# EAGLE design Staryu (EAGLE 8.0.2)
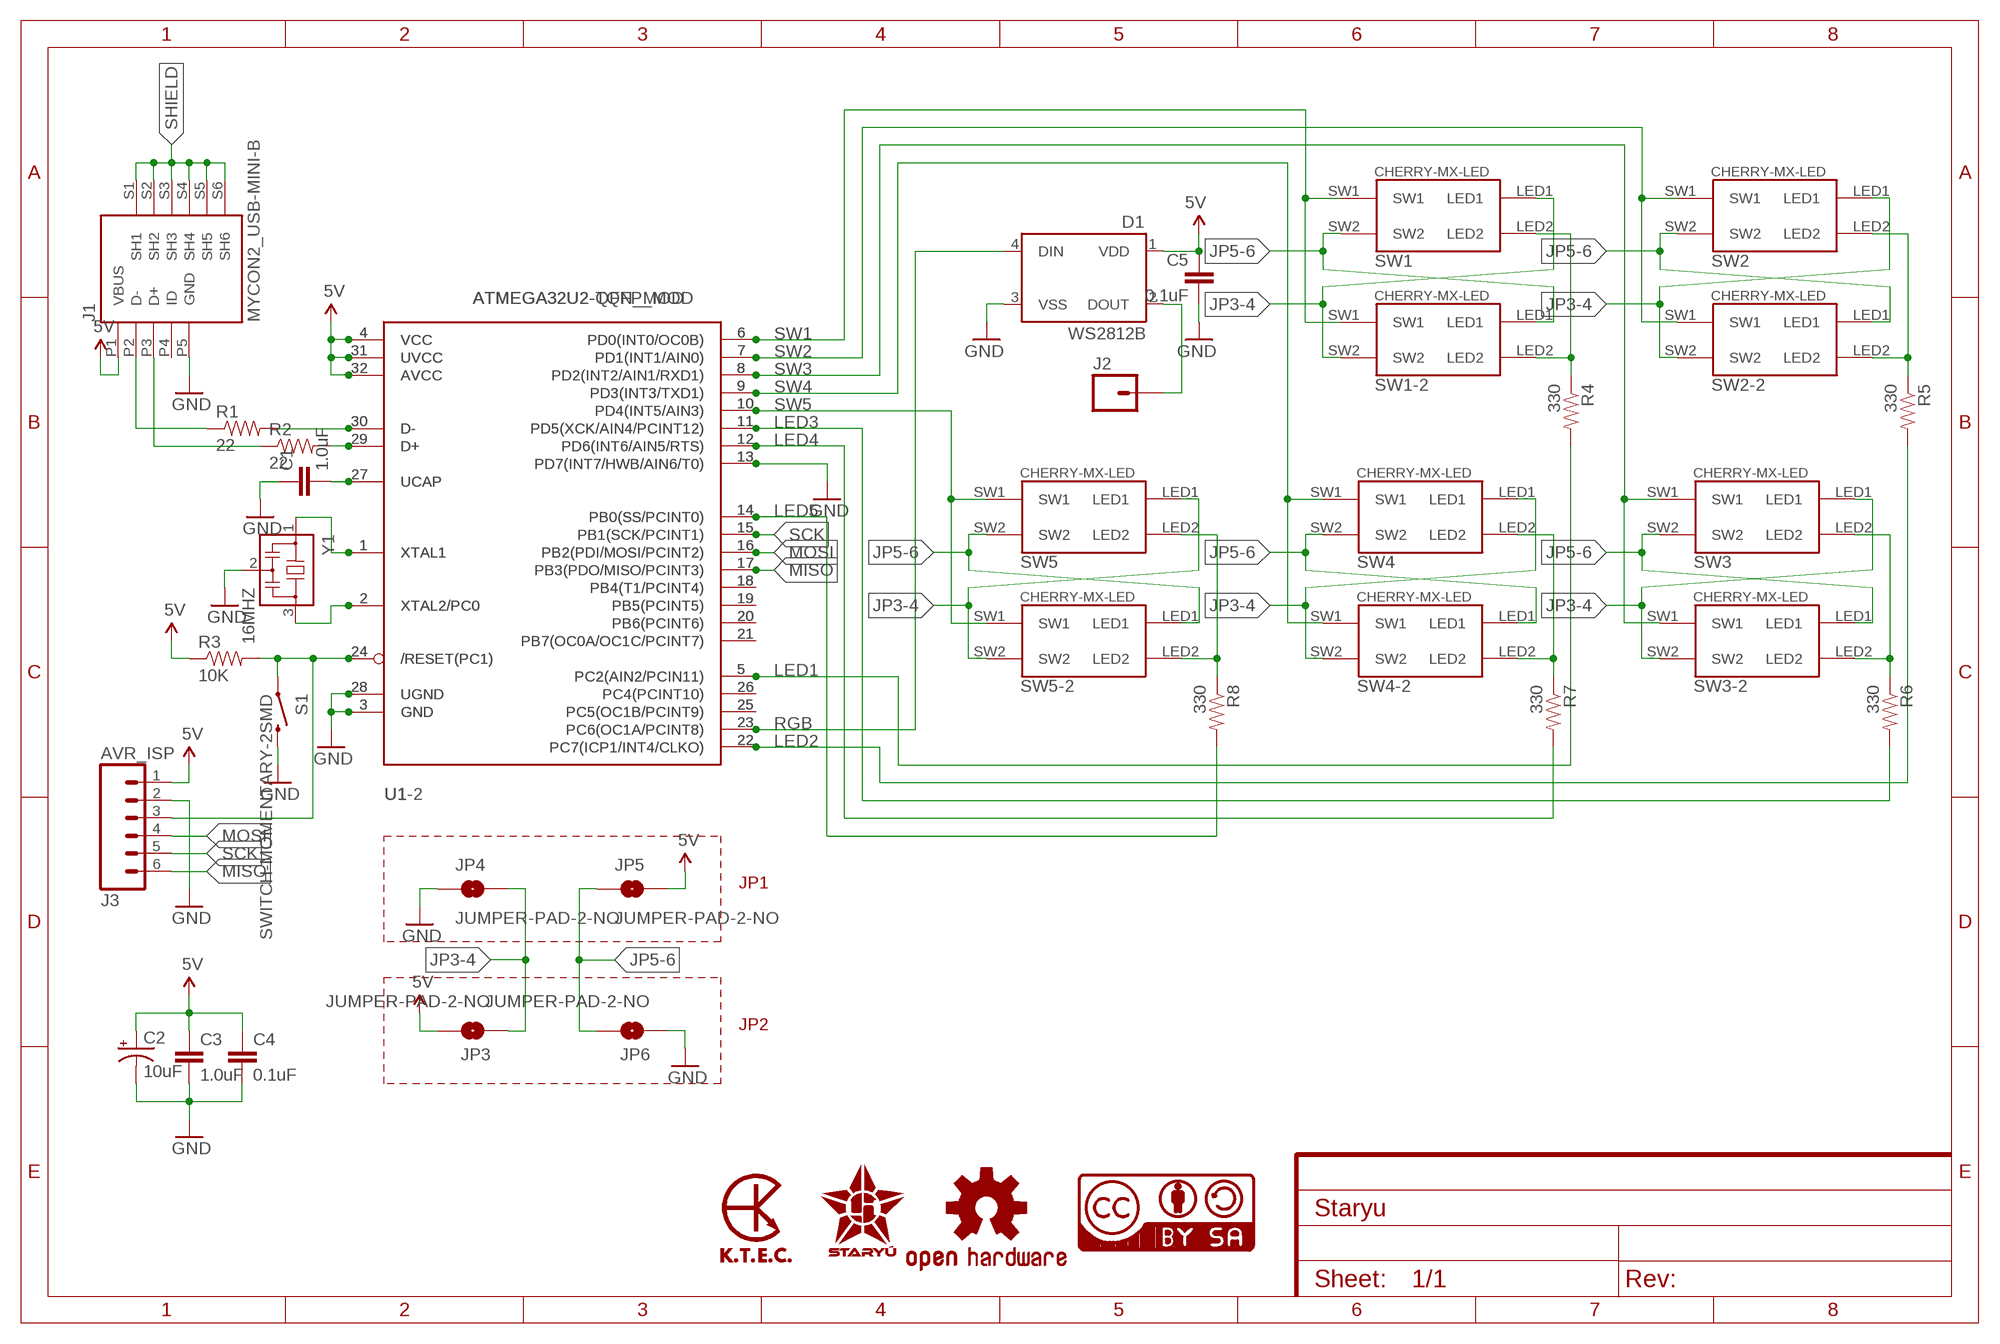
[diagram p0: schematic, sheet 1]
FRAME1 (FRAME-A4L): CREVISION: 1.6; DESIGNER: Kai Ryu

## Parts
C1  1.0uF  1.0UF-25V-+80/-20(0805)"  [0805-CAP]
C2  10uF  10UF-16V-10%(TANT)  [EIA3216]
C3  1.0uF  1.0UF-25V-+80/-20(0805)"  [0805-CAP]
C4  0.1uF  CAP0805  [0805]
C5  0.1uF  CAP0805  [0805]
D1  WS2812B  WS2812BNOSILK  [WS2812B_NOSILK]
J1  MYCON2_USB-MINI-B  [CON2_USB_MICRO_B_AT]
J2  M01PTH_NO_SILK_YES_STOP  [1X01_NO_SILK]
J3  AVR_ISP  M06NO_SILK_FEMALE_PTH  [1X06_NO_SILK]
JP3  JUMPER-PAD-2-NO  [PAD-JUMPER-2-NO_NO_SILK]
JP4  JUMPER-PAD-2-NO  [PAD-JUMPER-2-NO_NO_SILK]
JP5  JUMPER-PAD-2-NO  [PAD-JUMPER-2-NO_NO_SILK]
JP6  JUMPER-PAD-2-NO  [PAD-JUMPER-2-NO_NO_SILK]
LOGO1  K.T.E.C._LOGO3_COPPER_EXP_S  [K.T.E.C._LOGO3_COPPER_EXPOSED_S]
LOGO2  STARYU_LOGO  [STARYU_LOGO]
LOGO3  OSHW_LOGOM_EXP  [OSHW_LOGO_COPPER_EXPOSED_M]
LOGO4  CC-BY-SANIX  [CC-BY-SA_NIX]
R1  22  RESISTOR0805-RES  [0805]
R2  22  RESISTOR0805-RES  [0805]
R3  10K  RESISTOR0805-RES  [0805]
R4  330  RESISTOR0805-RES  [0805]
R5  330  RESISTOR0805-RES  [0805]
R6  330  RESISTOR0805-RES  [0805]
R7  330  RESISTOR0805-RES  [0805]
R8  330  RESISTOR0805-RES  [0805]
S1  SWITCH-MOMENTARY-2SMD  [TACTILE-SWITCH-SMD]
SW1  CHERRY-MX-LED-MOD  [CHERRY-MX-LED-MOD]
SW1-2  CHERRY-MX-LED-MOD  [CHERRY-MX-LED-MOD]
SW2  CHERRY-MX-LED-MOD  [CHERRY-MX-LED-MOD]
SW2-2  CHERRY-MX-LED-MOD  [CHERRY-MX-LED-MOD]
SW3  CHERRY-MX-LED-MOD  [CHERRY-MX-LED-MOD]
SW3-2  CHERRY-MX-LED-MOD  [CHERRY-MX-LED-MOD]
SW4  CHERRY-MX-LED-MOD  [CHERRY-MX-LED-MOD]
SW4-2  CHERRY-MX-LED-MOD  [CHERRY-MX-LED-MOD]
SW5  CHERRY-MX-LED-MOD  [CHERRY-MX-LED-MOD]
SW5-2  CHERRY-MX-LED-MOD  [CHERRY-MX-LED-MOD]
U1  ATMEGA32U2-TQFP_MOD  [TQFP32-08_MOD]
U1-2  ATMEGA32U2-QFN_MOD  [QFN32_MOD]
Y1  16MHZ  CSTCE16M0V53-R0  [CST]

## Nets
5V [VCC]: C2.A(+) C3.1 C4.1 C5.1 D1.1(VDD) J1.P1(VBUS) J3.1 JP3.2 JP5.2 R3.1 U1-2.4(VCC) U1-2.31(UVCC) U1-2.32(AVCC) U1.4(VCC) U1.31(UVCC) U1.32(AVCC)
GND [GND]: C1.1 C2.C(-) C3.2 C4.2 C5.2 D1.3(VSS) J1.P5(GND) J3.2 JP4.1 JP6.1 S1.3 U1-2.3(GND) U1-2.13(PD7(INT7/HWB/AIN6/T0)) U1-2.28(UGND) U1.3(GND) U1.13(PD7(INT7/HWB/AIN6/T0)) U1.28(UGND) Y1.2
JP3-4: JP3.1 JP4.2 SW1-2.SW2 SW1.LED1 SW2-2.SW2 SW2.LED1 SW3-2.SW2 SW3.LED1 SW4-2.SW2 SW4.LED1 SW5-2.SW2 SW5.LED1
JP5-6: JP5.1 JP6.2 SW1-2.LED1 SW1.SW2 SW2-2.LED1 SW2.SW2 SW3-2.LED1 SW3.SW2 SW4-2.LED1 SW4.SW2 SW5-2.LED1 SW5.SW2
LED1 [GND]: R4.2 U1-2.5(PC2(AIN2/PCIN11)) U1.5(PC2(AIN2/PCIN11))
LED2: R5.2 U1-2.22(PC7(ICP1/INT4/CLKO)) U1.22(PC7(ICP1/INT4/CLKO))
LED3: R6.2 U1-2.11(PD5(XCK/AIN4/PCINT12)) U1.11(PD5(XCK/AIN4/PCINT12))
LED4: R7.2 U1-2.12(PD6(INT6/AIN5/RTS)) U1.12(PD6(INT6/AIN5/RTS))
LED5: R8.2 U1-2.14(PB0(SS/PCINT0)) U1.14(PB0(SS/PCINT0))
MISO: J3.6 U1-2.17(PB3(PDO/MISO/PCINT3)) U1.17(PB3(PDO/MISO/PCINT3))
MOSI: J3.4 U1-2.16(PB2(PDI/MOSI/PCINT2)) U1.16(PB2(PDI/MOSI/PCINT2))
N$1: R2.2 U1-2.29(D+) U1.29(D+)
N$2: R1.2 U1-2.30(D-) U1.30(D-)
N$3: J1.P2(D-) R1.1
N$4: J1.P3(D+) R2.1
N$5: U1-2.1(XTAL1) U1.1(XTAL1) Y1.1
N$6: U1-2.2(XTAL2/PC0) U1.2(XTAL2/PC0) Y1.3
N$7: C1.2 U1-2.27(UCAP) U1.27(UCAP)
N$8: J3.3 R3.2 S1.1 U1-2.24(/RESET(PC1)) U1.24(/RESET(PC1))
N$9: D1.2(DOUT) J2.1
N$10: R5.1 SW2-2.LED2 SW2.LED2
N$11: R6.1 SW3-2.LED2 SW3.LED2
N$12: R7.1 SW4-2.LED2 SW4.LED2
N$13: R8.1 SW5-2.LED2 SW5.LED2
N$20: U1-2.18(PB4(T1/PCINT4)) U1.18(PB4(T1/PCINT4))
N$21: U1-2.19(PB5(PCINT5)) U1.19(PB5(PCINT5))
N$22: U1-2.20(PB6(PCINT6)) U1.20(PB6(PCINT6))
N$23: U1-2.21(PB7(OC0A/OC1C/PCINT7)) U1.21(PB7(OC0A/OC1C/PCINT7))
N$24: U1-2.26(PC4(PCINT10)) U1.26(PC4(PCINT10))
N$25: U1-2.25(PC5(OC1B/PCINT9)) U1.25(PC5(OC1B/PCINT9))
N$29: R4.1 SW1-2.LED2 SW1.LED2
RGB: D1.4(DIN) U1-2.23(PC6(OC1A/PCINT8)) U1.23(PC6(OC1A/PCINT8))
SCK: J3.5 U1-2.15(PB1(SCK/PCINT1)) U1.15(PB1(SCK/PCINT1))
SHIELD [SHIELD]: J1.S1(SH1) J1.S2(SH2) J1.S3(SH3) J1.S4(SH4) J1.S5(SH5) J1.S6(SH6)
SW1: SW1-2.SW1 SW1.SW1 U1-2.6(PD0(INT0/OC0B)) U1.6(PD0(INT0/OC0B))
SW2: SW2-2.SW1 SW2.SW1 U1-2.7(PD1(INT1/AIN0)) U1.7(PD1(INT1/AIN0))
SW3: SW3-2.SW1 SW3.SW1 U1-2.8(PD2(INT2/AIN1/RXD1)) U1.8(PD2(INT2/AIN1/RXD1))
SW4: SW4-2.SW1 SW4.SW1 U1-2.9(PD3(INT3/TXD1)) U1.9(PD3(INT3/TXD1))
SW5: SW5-2.SW1 SW5.SW1 U1-2.10(PD4(INT5/AIN3)) U1.10(PD4(INT5/AIN3))
Unconnected: J1.P4(ID)

## Notes on the sheet
- JP1
- JP2

## Library data of the parts
C1 C3 = SparkFun-Capacitors:1.0UF-25V-+80/-20(0805): CAP-11625; PROD_ID: CAP-11625
C2 = SparkFun-Capacitors:10UF-16V-10%(TANT): CAP-00811 1206/EIA-3216 Tantalum capacitor; PROD_ID: CAP-00811
C4 C5 = SparkFun-Capacitors:CAP: Capacitor Standard 0603 ceramic capacitor, and 0.1" leaded capacitor.
D1 = ws2812:WS2812B: WS2812B - Intelligent control LED integrated light source Technical Specifications: Power Supply Voltage (VDD): 3.5 to 5.3 V Input Voltage (VI): -0.5 to VDD+0.5 V Operating Junction Temperature (Topt): -25°C to +80°C Storage Temperature Range (Tstg): -55°C to +150°C
J1 = usb-micro-b:MYCON2_USB-MINI-B
J2 = SparkFun-Connectors:M01: Header 1 Standard 1-pin 0.1" header. Use with straight break away headers (SKU : PRT-00116), right angle break away headers (PRT-00553), swiss pins (PRT-00743), machine pins (PRT-00117), and female headers (PRT-00115). SMTSO-256-ET is a "flush mount" nut for a 4-40 screw. The older package used to be too tight, and did not allow it to sit properly thru the drill hit. The latest (0.165DIA) fits nice and snug.
J3 = SparkFun-Connectors:M06: Header 6 Standard 6-pin 0.1" header. Use with straight break away headers (SKU : PRT-00116), right angle break away headers (PRT-00553), swiss pins (PRT-00743), machine pins (PRT-00117), and female headers (PRT-00115). Molex polarized connector foot print use with SKU : PRT-08094 with associated crimp pins and housings. NOTES ON THE VARIANTS LOCK and LOCK_LONGPADS... This footprint was designed to help hold the alignment of a through-hole component (i.e. 6-pin header) while soldering it into place. You may notice that each hole has been shifted either up or down by 0.005 of an inch from it's more standard position (which is a perfectly straight line). This slight alteration caused the pins (the squares in the middle) to touch the edges of the holes. Because they are alternating, it causes a "brace" to hold the component in place. 0.005 has proven to be the perfect amount of "off-center" position when using our standard breakaway headers. Although looks a little odd when you look at the bare footprint, once you have a header in there, the alteration is very hard to notice. Also,if you push a header all the way into place, it is covered up entirely on the bottom side. This idea of altering the position of holes to aid alignment will be further integrated into the Sparkfun Library for other footprints. It can help hold any component with 3 or more connection pins.; PROD_ID: CONN-08437
JP3-JP6 = SparkFun-Passives:JUMPER-PAD-2-NO
LOGO1 = logo:K.T.E.C._LOGO3
LOGO2 = Noukensha:STARYU_LOGO
LOGO3 = Noukensha:OSHW_LOGO: Open Source Hardware Logo This logo indicates the piece of hardware it is found on incorporates a OSHW license and/or adheres to the definition of open source hardware found here: http://freedomdefined.org/OSHW
LOGO4 = cc-by-sa:CC-BY-SA: All hardware is licensed under the Creative Commons Attribution-Noncommercial-Share Alike 2.5 Switzerland License. To view a copy of this license, visit http://creativecommons.org/licenses/by-nc-sa/2.5/ch/ or send a letter to Creative Commons, 171 Second Street, Suite 300, San Francisco, California, 94105, USA.
R1-R8 = SparkFun-Resistors:RESISTOR: Resistor Basic schematic elements and footprints for 0603, 1206, and PTH resistors.
S1 = SparkFun-Electromechanical:SWITCH-MOMENTARY-2: Various NO switches- pushbuttons, reed, etc; PROD_ID: SWCH-08247
SW1 SW1-2 SW2 SW2-2 SW3 SW3-2 SW4 SW4-2 SW5 SW5-2 = cherrymx:CHERRY-MX-LED: Cherry MX series keyswitch with LED
U1 U1-2 = atmega32u2:ATMEGA32U2: ATmega32u2 Pin compatible with the atmega8u2, atmega16u2 and atmega32u2 8, 16 or 32 K flash, 1K RAM, 512b EEPROM 8 bit and 16 bit timer (5 PWM total) UART, SPI (no I2C!) USB with 4 endpoints, LUFA compatible 22 I/O lines, analog comparator (no ADC!) Comes with DFU bootloader burned in!
Y1 = cst-resonator:CSTCE: Resonator Source: murata.co.jp

## Net classes
1 VCC: width 0.254 mm
2 GND: width 0.254 mm
3 SHIELD: width 0.406 mm, clearance 0.508 mm

## Board
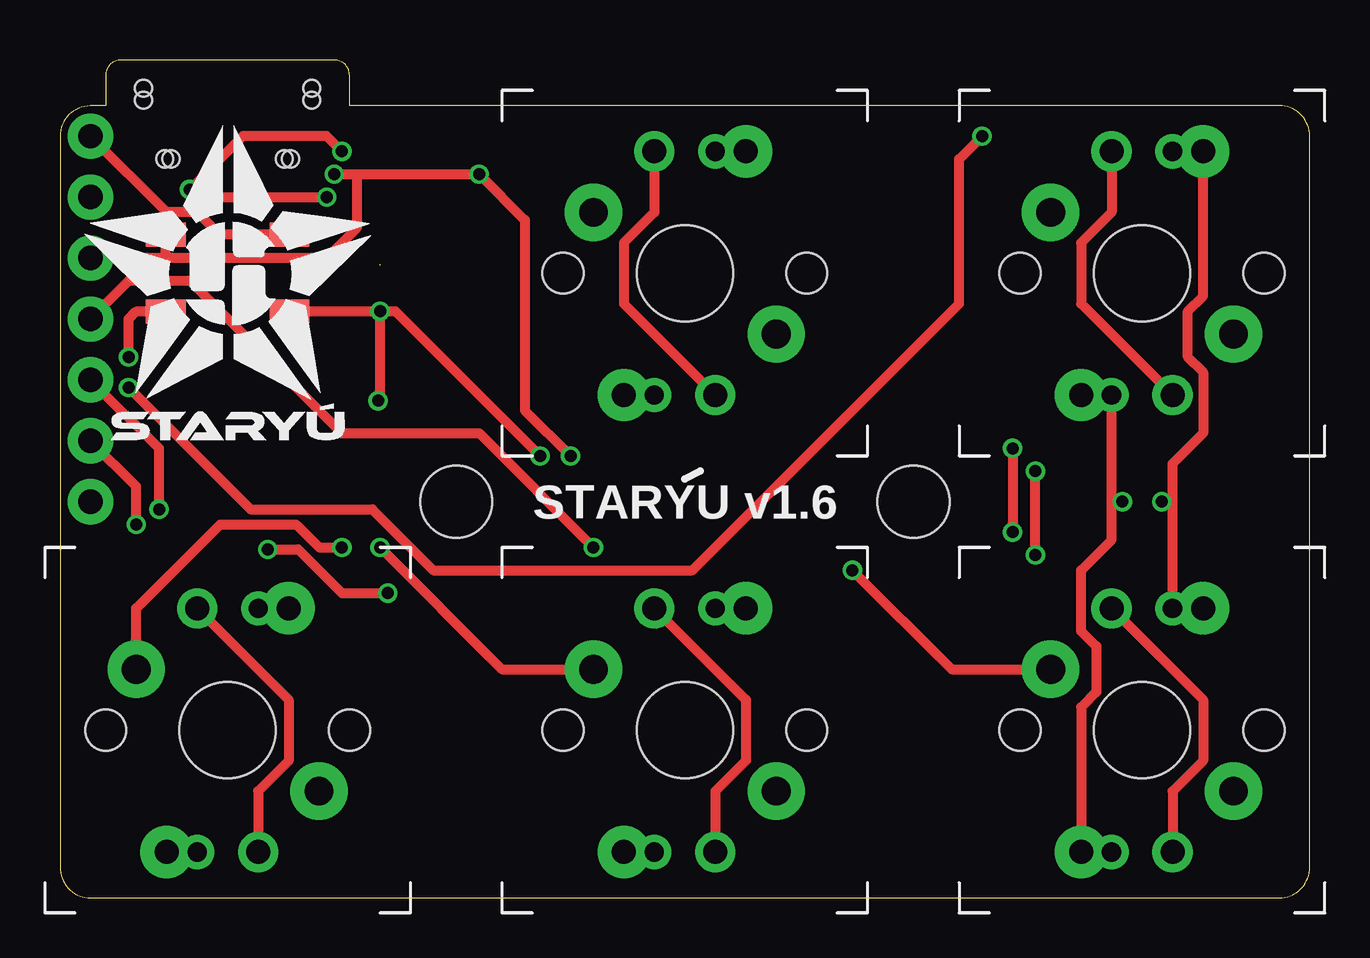
[diagram p1: board, top side]
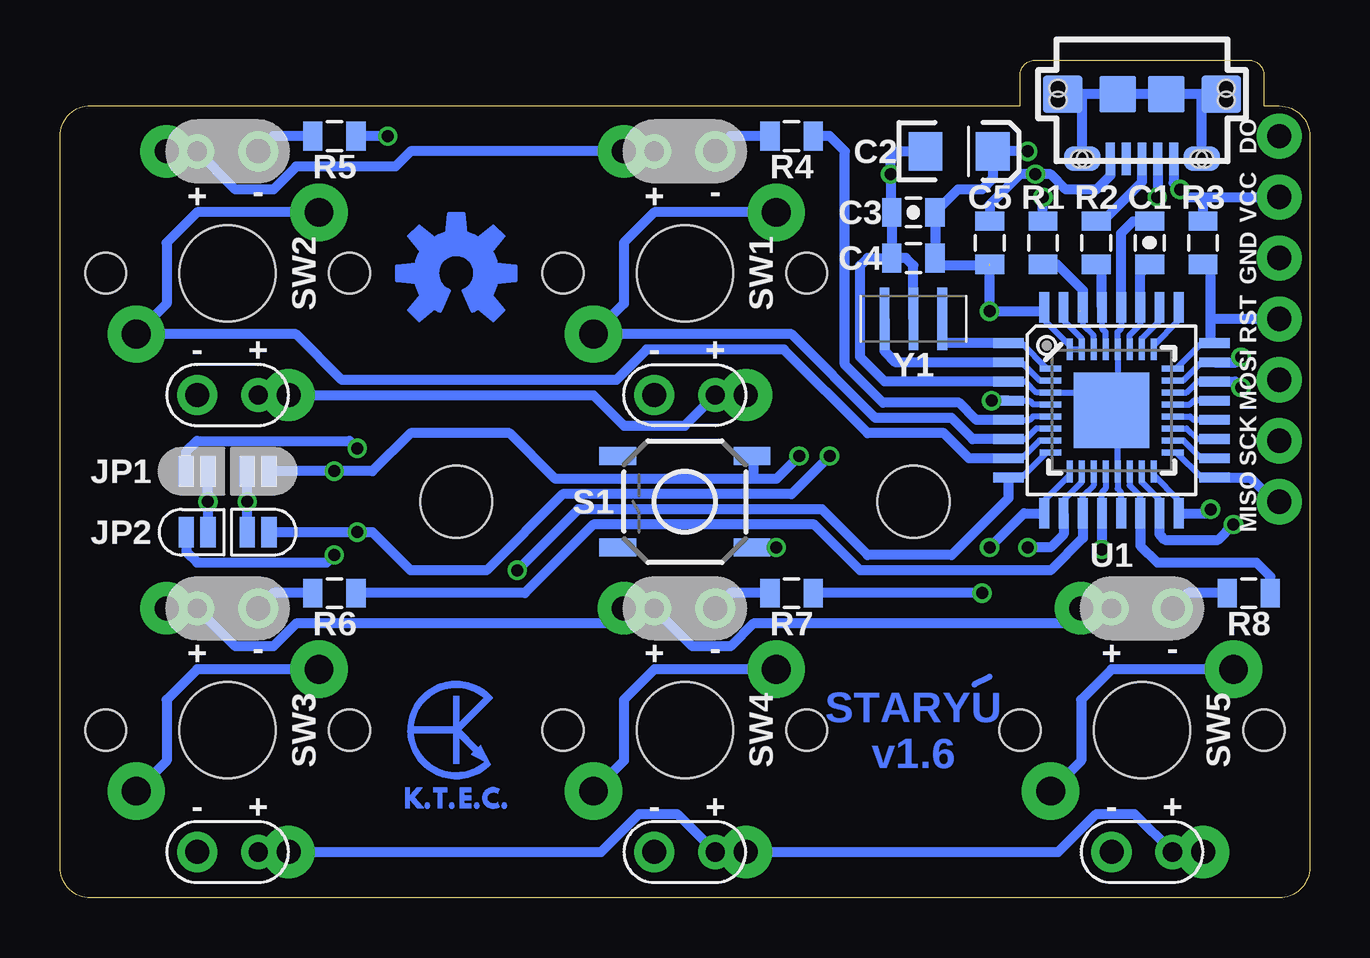
[diagram p2: board, bottom side, seen from below]

Size 52.07 x 34.93 mm. Coordinates in mm from the lower left corner, seen from the top.
Outline: 0,31.75 0,1.27 arc90 1.27,0 50.8,0 arc90 52.07,1.27 52.07,31.75 arc90 50.8,33.02 12.07,33.02 12.07,34.29 arc90 11.43,34.93 2.54,34.93 arc90 1.91,34.29 1.91,33.01 1.26,33.01 arc90 0,31.75
Copper layers (1*16): Top 0.035mm / dielectric 1.5mm / Bottom 0.035mm
Design rules "SeeedStudio_2layer_DRU_no_angle_20140221 *": minimum track width 6mil, minimum drill 12mil, track to track 6mil, track to pad 6mil, pad to pad 6mil, via to via 6mil, smd to smd 0mil, copper to edge 10mil, drill to drill 10mil, minimum pad ring 10mil, minimum via ring 6mil, stop-mask expansion 2mil, vias tented up to drill 100mil, thermal gap 10mil
Holes 3 mm at 16.51,16.51 35.56,16.51

### Footprints (pad centres in the part's own frame; a part is rotated, then mirrored left to right if it is on the bottom)
0805-CAP = smd 0.8 x 1.2: 1 -0.9,0; 2 0.9,0
EIA3216 = smd 1.4 x 1.6: A 1.4,0; C -1.4,0
0805 = smd 0.8 x 1.2: 1 -0.9,0; 2 0.9,0
WS2812B_NOSILK = smd 1.651 x 1: 1 -2.577,1.6; 2 -2.577,-1.6; 3 2.577,-1.6; 4 2.577,1.6
CON2_USB_MICRO_B_AT = smd 0.406 x 1.346: P1 -1.321,2.692; P2 -0.66,2.692; P3 0,2.692; P4 0.66,2.692; P5 1.321,2.692 | smd 1.651 x 1.549: S1 -3.302,0; S2 3.302,0 | smd 1.524 x 1.016: S3 -2.489,2.692; S4 2.489,2.692 | smd 1.524 x 1.524: S5 -1.016,0; S6 1.016,0 | hole 0.7: -3.505,0.254; -3.505,-0.254; 3.505,0.254; 3.505,-0.254; -2.616,2.692; -2.362,2.692; 2.362,2.692; 2.616,2.692
1X01_NO_SILK = drill 1.016 pad 1.88: 1 0,0
1X06_NO_SILK = drill 1.016 pad 1.88: 1 0,0; 2 2.54,0; 3 5.08,0; 4 7.62,0; 5 10.16,0; 6 12.7,0
PAD-JUMPER-2-NO_NO_SILK = smd 0.635 x 1.27: 1 -0.45,0; 2 0.45,0
TACTILE-SWITCH-SMD = smd 1.524 x 0.762: 1 -2.794,1.905; 2 2.794,1.905; 3 -2.794,-1.905; 4 2.794,-1.905
CHERRY-MX-LED-MOD = drill 0.8 pad 1.422: LED1 -1.27,-5.08 | drill 1 pad 1.676: LED2 1.27,-5.08 | drill 1.2 pad 2.388: SW1 -3.81,2.54 | drill 1 pad 2.184: SW2 2.54,5.08 | hole 4: 0,0 | hole 1.702: -5.08,0; 5.08,0
TQFP32-08_MOD = smd 1.27 x 0.406: 1 -4.293,2.8; 2 -4.293,2; 3 -4.293,1.2; 4 -4.293,0.4; 5 -4.293,-0.4; 6 -4.293,-1.2; 7 -4.293,-2; 8 -4.293,-2.8; 17 4.293,-2.8; 18 4.293,-2; 19 4.293,-1.2; 20 4.293,-0.4; 21 4.293,0.4; 22 4.293,1.2; 23 4.293,2; 24 4.293,2.8 | smd 0.406 x 1.27: 9 -2.8,-4.293; 10 -2,-4.293; 11 -1.2,-4.293; 12 -0.4,-4.293; 13 0.4,-4.293; 14 1.2,-4.293; 15 2,-4.293; 16 2.8,-4.293; 25 2.8,4.293; 26 2,4.293; 27 1.2,4.293; 28 0.4,4.293; 29 -0.4,4.293; 30 -1.2,4.293; 31 -2,4.293; 32 -2.8,4.293
QFN32_MOD = smd 0.9 x 0.25: 1 -2.55,1.75; 2 -2.55,1.25; 3 -2.55,0.75; 4 -2.55,0.25; 5 -2.55,-0.25; 6 -2.55,-0.75; 7 -2.55,-1.25; 8 -2.55,-1.75; 17 2.55,-1.75; 18 2.55,-1.25; 19 2.55,-0.75; 20 2.55,-0.25; 21 2.55,0.25; 22 2.55,0.75; 23 2.55,1.25; 24 2.55,1.75 | smd 0.25 x 0.9: 9 -1.75,-2.55; 10 -1.25,-2.55; 11 -0.75,-2.55; 12 -0.25,-2.55; 13 0.25,-2.55; 14 0.75,-2.55; 15 1.25,-2.55; 16 1.75,-2.55; 25 1.75,2.55; 26 1.25,2.55; 27 0.75,2.55; 28 0.25,2.55; 29 -0.25,2.55; 30 -0.75,2.55; 31 -1.25,2.55; 32 -1.75,2.55 | smd 3.15 x 3.15: EP 0,0
CST = smd 0.4 x 2.6: 1 -1.2,0; 2 0,0; 3 1.2,0

### Placement (x,y rotation side)
C1  6.67,27.3 270 bottom
C2  14.61,31.12 0 bottom
C3  16.51,28.57 180 bottom
C4  16.51,26.67 180 bottom
C5  13.34,27.3 90 bottom
D1  6.99,26.04 180 top
J1  6.99,33.5 180 bottom
J2  1.27,31.75 0 top
J3  1.27,29.21 270 top
JP3  43.81,15.24 0 bottom
JP4  43.81,17.78 180 bottom
JP5  46.36,17.78 180 bottom
JP6  46.36,15.24 0 bottom
LOGO1  35.56,6.99 0 bottom
LOGO2  6.99,26.04 0 top
LOGO3  35.56,26.04 0 bottom
LOGO4  35.56,24.45 0 top
R1  11.11,27.3 270 bottom
R2  8.89,27.3 270 bottom
R3  4.45,27.3 270 bottom
R4  21.59,31.75 0 bottom
R5  40.64,31.75 0 bottom
R6  40.64,12.7 0 bottom
R7  21.59,12.7 0 bottom
R8  2.54,12.7 0 bottom
S1  26.04,16.51 180 bottom
SW1  26.04,26.04 0 top
SW1-2  26.04,26.04 180 top
SW2  45.09,26.04 0 top
SW2-2  45.09,26.04 180 top
SW3  45.09,6.99 0 top
SW3-2  45.09,6.99 180 top
SW4  26.04,6.99 0 top
SW4-2  26.04,6.99 180 top
SW5  6.99,6.99 0 top
SW5-2  6.99,6.99 180 top
U1  8.25,20.32 0 bottom
U1-2  8.25,20.32 0 bottom
Y1  16.51,24.13 180 bottom

### Tracks (layer width: path | path; a pad name or v marks a point on that pad's centre or on a via)
5V  (via drill 0.5)  (2 unrouted)
  Top 0.406: v11.75,31.12 11.11,31.75 7.62,31.75 v5.4,29.53 | 9.57,24.45 v13.34,24.45 | v39.69,18.73 v39.69,15.24 | v13.34,24.45 13.34,20.8 v13.25,20.72 | v13.34,24.45 13.97,24.45 v20,18.41
  Bottom 0.254: U1.31 10.25,24.07 9.5,23.32 U1-2.31 U1-2.32 10,23.02 11.05,24.07 U1.32 | U1-2.4 11.52,20.57 11.67,20.72 U1.4
  Bottom 0.406: R3.1 4.45,29.21 | 13.02,26.35 13.34,26.35 | v11.75,31.12 C2.A 13.2,29.98 13.65,29.53 14.66,29.53 C3.1 C4.1 15.29,26.35 13.34,26.35 | J1.P1 5.66,29.79 v5.4,29.53 5.08,29.21 4.45,29.21 | 4.45,29.21 J3.1 | v20,18.41 21.59,16.83 31.12,16.83 34.29,13.65 37.47,13.65 39.05,15.24 v39.69,15.24 JP3.2 | 13.34,26.35 v13.34,24.45 11.05,24.45 U1.32 | JP5.2 46.8,18.6 46.36,19.05 40.01,19.05 v39.69,18.73 | U1.4 v13.25,20.72
GND  (via drill 0.5)
  Top 0.406: v11.43,30.16 12.38,30.16 | 12.38,30.16 v17.46,30.16 19.37,28.26 19.37,20.32 v21.27,18.41 | 12.38,30.16 12.38,27.94 11.11,26.67 4.41,26.67 | 4.41,26.67 J3.2 | 4.41,26.67 D1.3 | v40.64,14.29 v40.64,17.78
  Bottom 0.254: U1.13 7.85,16.9 8,17.05 U1-2.13 8,21.07 | U1.28 7.85,23.74 8,23.59 U1-2.28 8,21.07 | U1.3 11.84,21.52 11.39,21.07 U1-2.3 8,21.07
  Bottom 0.406: C4.2 C3.2 17.46,28.63 v17.46,30.16 17.46,30.8 17.14,31.12 C2.C 15.88,31.24 | C1.1 7.35,28.21 7.85,27.71 U1.28 | Y1.2 16.51,26.35 16.83,26.67 C4.2 | J1.P5 8.31,30.11 8.89,29.53 10.16,29.53 10.8,30.16 v11.43,30.16 12.07,30.16 13.34,28.89 C5.2 | C4.2 18.41,26.67 18.73,26.35 18.73,22.54 17.71,21.52 U1.3 | JP6.1 46.8,14.42 46.36,13.97 40.96,13.97 v40.64,14.29 | JP4.1 v40.64,17.78 39.05,17.78 37.47,19.37 33.34,19.37 31.43,17.46 23.18,17.46 | v21.27,18.41 22.23,17.46 23.18,17.46 | S1.3 23.18,18.35 23.18,17.46
JP3-4  (via drill 0.5)
  Top 0.406: SW3-2.SW2 42.55,7.94 43.18,8.57 43.18,10.48 42.55,11.11 42.55,13.65 43.81,14.92 43.81,16.51 | 43.81,16.51 SW2.LED1 | 43.81,16.51 v44.27,16.51
  Bottom 0.406: SW2.LED1 SW2-2.SW2 29.84,20.96 28.57,19.69 26.04,19.69 SW1.LED1 SW1-2.SW2 | SW5-2.SW2 SW5.LED1 7.3,3.49 8.89,3.49 10.48,1.91 SW4-2.SW2 SW4.LED1 26.35,3.49 27.94,3.49 29.53,1.91 SW3-2.SW2 SW3.LED1 | JP3.1 v44.27,16.51 JP4.2
JP5-6  (via drill 0.5)
  Top 0.406: SW2.SW2 47.62,25.08 46.99,24.45 46.99,22.54 47.62,21.91 47.62,19.37 46.36,18.1 46.36,16.51 | SW3-2.LED1 46.36,16.51 | 46.36,16.51 v45.91,16.51
  Bottom 0.406: SW1-2.LED1 SW1.SW2 37.47,31.12 38.1,30.48 42.23,30.48 43.18,29.53 44.77,29.53 SW2-2.LED1 SW2.SW2 | SW3.SW2 SW3-2.LED1 44.77,10.48 43.18,10.48 42.23,11.43 29.21,11.43 SW4.SW2 SW4-2.LED1 25.72,10.48 24.13,10.48 23.18,11.43 10.16,11.43 SW5.SW2 SW5-2.LED1 | JP6.2 v45.91,16.51 JP5.1
LED1
  Bottom 0.254: U1-2.5 11.52,20.07 11.67,19.92 U1.5
  Bottom 0.406: U1.5 13.89,19.92 14.61,20.64 17.78,20.64 19.37,22.23 19.37,31.12 20,31.75 R4.2
LED2  (via drill 0.5)
  Top 0.406: v38.42,31.75 37.47,30.8 37.47,24.77 26.35,13.65 15.56,13.65 13.02,16.19 7.94,16.19 v2.86,21.27
  Bottom 0.254: U1-2.22 5.12,21.07 4.67,21.52 U1.22
  Bottom 0.406: v38.42,31.75 R5.2 | U1.22 3.1,21.52 v2.86,21.27
LED3
  Bottom 0.254: U1-2.11 9,17.19 9.45,16.74 U1.11
  Bottom 0.406: U1.11 9.45,14.99 10.8,13.65 18.73,13.65 20.64,15.56 29.84,15.56 32.7,12.7 R6.2
LED4  (via drill 0.5)
  Top 0.406: v8.66,14.52 9.93,14.52 11.75,12.7 v13.65,12.7
  Bottom 0.254: U1-2.12 8.5,17.05 8.66,16.9 U1.12
  Bottom 0.406: U1.12 v8.66,14.52 | v13.65,12.7 R7.2
LED5
  Bottom 0.254: U1-2.14 7.5,17.19 7.06,16.74 U1.14
  Bottom 0.406: U1.14 7.06,14.68 6.35,13.97 2.22,13.97 1.64,13.39 R8.2
MISO
  Bottom 0.254: U1-2.17 5.55,18.57 4.5,17.52 U1.17
  Bottom 0.406: U1.17 2.48,17.52 1.47,16.51 J3.6
MOSI  (via drill 0.5)
  Top 0.406: v4.13,16.19 4.13,18.73 J3.4
  Bottom 0.254: U1-2.16 6.5,17.62 5.46,16.57 U1.16
  Bottom 0.406: U1.16 4.29,16.03 v4.13,16.19
N$1
  Bottom 0.254: U1-2.29 8.5,23.59 8.66,23.74 U1.29
  Bottom 0.406: U1.29 8.66,26.17 R2.2
N$2
  Bottom 0.254: U1-2.30 9,23.45 9.45,23.9 U1.30
  Bottom 0.406: R1.2 10.53,26.41 9.45,25.33 U1.30
N$3  (via drill 0.5)
  Top 0.406: v6.35,29.21 v11.11,29.21
  Bottom 0.406: R1.1 v11.11,29.21 | J1.P2 6.33,29.23 v6.35,29.21
N$4
  Bottom 0.406: R2.1 8.62,28.21 6.99,29.84 J1.P3
N$5
  Bottom 0.254: U1-2.1 10.96,22.07 12.01,23.12 U1.1
  Bottom 0.406: U1.1 15.31,23.12 Y1.1
N$6
  Bottom 0.254: U1-2.2 11.25,21.57 12,22.32 U1.2
  Bottom 0.406: Y1.3 17.71,22.79 17.24,22.32 U1.2
N$7
  Bottom 0.254: U1-2.27 7.5,23.45 7.06,23.9 U1.27
  Bottom 0.406: U1.27 7.06,26.02 C1.2
N$8  (via drill 0.5)
  Top 0.406: J3.3 2.86,25.72 5.4,25.72 11.75,19.37 17.46,19.37 v22.23,14.61
  Bottom 0.254: U1-2.24 5.55,22.07 4.5,23.12 U1.24
  Bottom 0.406: v22.23,14.61 S1.1 | U1.24 4.13,23.29 4.13,24.13 | 4.13,24.13 4.13,26.04 4.45,26.35 R3.2 | J3.3 4.13,24.13
N$9
  Top 0.406: D1.2 6.66,27.64 5.72,28.57 4.45,28.57 J2.1
N$10
  Top 0.406: SW2-2.LED2 43.81,28.57 42.55,27.3 42.55,24.77 SW2.LED2
  Bottom 0.406: R5.1 43.18,31.75 SW2-2.LED2
N$11
  Top 0.406: SW3-2.LED2 47.62,8.25 47.62,5.72 46.36,4.45 SW3.LED2
  Bottom 0.406: R6.1 43.18,12.7 SW3-2.LED2
N$12
  Top 0.406: SW4-2.LED2 28.57,8.25 28.57,5.72 27.3,4.45 SW4.LED2
  Bottom 0.406: R7.1 24.13,12.7 SW4-2.LED2
N$13
  Top 0.406: SW5-2.LED2 9.52,8.25 9.52,5.72 8.25,4.45 SW5.LED2
  Bottom 0.406: R8.1 5.08,12.7 SW5-2.LED2
N$14
  Bottom 0.254: 13.97,8.89 13.34,9.21
N$20
  Bottom 0.254: U1-2.18 5.26,19.07 4.51,18.32 U1.18
N$21
  Bottom 0.254: U1-2.19 5.12,19.57 4.67,19.12 U1.19
N$22
  Bottom 0.254: U1-2.20 4.99,20.07 4.84,19.92 U1.20
N$23
  Bottom 0.254: U1-2.21 4.99,20.57 4.84,20.72 U1.21
N$24
  Bottom 0.254: U1-2.26 7,23.32 6.25,24.07 U1.26
N$25
  Bottom 0.254: U1-2.25 6.5,23.02 5.46,24.07 U1.25
N$29
  Top 0.406: SW1-2.LED2 24.77,28.57 23.5,27.3 23.5,24.77 SW1.LED2
  Bottom 0.406: R4.1 24.13,31.75 SW1-2.LED2
RGB  (via drill 0.5)
  Top 0.406: D1.4 3.16,24.44 2.86,24.13 v2.86,22.54
  Bottom 0.254: U1-2.23 5.26,21.57 4.51,22.32 U1.23
  Bottom 0.406: U1.23 3.08,22.32 v2.86,22.54
SCK  (via drill 0.5)
  Top 0.406: v3.17,15.56 3.17,17.14 J3.5
  Bottom 0.254: U1-2.15 7,17.32 6.25,16.57 U1.15
  Bottom 0.406: v3.17,15.56 3.81,14.92 6.03,14.92 6.25,15.14 U1.15
SHIELD
  Bottom 0.406: J1.S3 4.5,33.5 | 4.5,33.5 J1.S1 | J1.S4 9.47,33.5 J1.S2 J1.S6 J1.S5 4.5,33.5
  cutout Top (isolate 0.305): -1.27,36.83 -1.27,-1.27 53.34,-1.27 53.34,36.83
  cutout Bottom (isolate 0.305): -1.27,36.83 -1.27,-1.27 53.34,-1.27 53.34,36.83
SW1
  Bottom 0.254: U1-2.6 11.39,19.57 11.84,19.12 U1.6
  Bottom 0.406: U1.6 14.04,19.12 14.92,20 18.1,20 21.59,23.5 SW1-2.SW1 28.57,24.77 28.57,27.3 27.3,28.57 SW1.SW1
SW2
  Bottom 0.254: U1-2.7 11.25,19.07 12,18.32 U1.7
  Bottom 0.406: U1.7 14.19,18.32 15.24,19.37 18.41,19.37 21.91,22.86 27.62,22.86 28.89,21.59 40.32,21.59 42.23,23.5 SW2-2.SW1 47.62,24.77 47.62,27.3 46.36,28.57 SW2.SW1
SW3  (via drill 0.5)
  Top 0.406: SW3.SW1 37.15,9.52 v33.02,13.65
  Bottom 0.254: U1-2.8 10.96,18.57 12.01,17.52 U1.8
  Bottom 0.406: SW3.SW1 46.36,9.52 47.62,8.25 47.62,5.72 SW3-2.SW1 | v33.02,13.65 30.48,16.19 20.32,16.19 18.41,14.29 14.92,14.29 12.55,16.66 U1.8
SW4  (via drill 0.5)
  Top 0.406: SW4.SW1 18.41,9.52 v13.34,14.61
  Bottom 0.254: U1-2.9 10,17.62 11.05,16.57 U1.9
  Bottom 0.406: SW4.SW1 27.3,9.52 28.57,8.25 28.57,5.72 SW4-2.SW1 | v13.34,14.61 11.91,16.03 U1.9
SW5  (via drill 0.5)
  Top 0.406: SW5.SW1 3.17,12.07 6.67,15.56 9.84,15.56 10.8,14.61 v11.75,14.61
  Bottom 0.254: U1-2.10 9.5,17.32 10.25,16.57 U1.10
  Bottom 0.406: SW5.SW1 8.25,9.52 9.52,8.25 9.52,5.72 SW5-2.SW1 | U1.10 10.25,15.14 10.8,14.61 v11.75,14.61

### Text on the board
Bottom: STARYU / v1.6
tNames: STARYU v1.6
bNames: DO | VCC | - | + | - | + | GND | SW1 | SW2 | RST | + | - | + | - | MOSI | SCK | JP1 | MISO | JP2 | - | + | - | + | - | + | SW5 | SW4 | SW3 | + | - | + | - | + | -
bStop: STARYU / v1.6